# Altium project Practica RADAR.PrjPCB (part 2 of 3)

## Sheet USB PHY.SchDoc: USB PHY
size A4; Organization: GMR UPM; DocumentNumber: 4; Revision: A; SheetNumber: 4; SheetTotal: 8
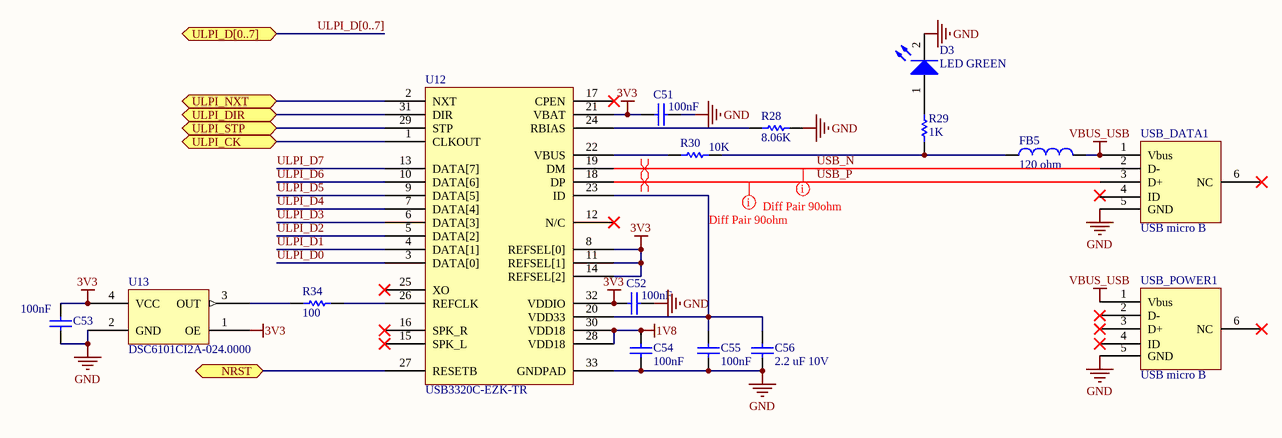
[diagram p3: USB PHY.SchDoc]

### Parts
C51  100nF  [0603 Cap]
C52  100nF  [0603 Cap]
C53  100nF  [0603 Cap]
C54  100nF  [0603 Cap]
C55  100nF  [0603 Cap]
C56  2.2 uF 10V  [0603 Cap]
D3  LED GREEN  [0603 LED]
FB5  120 ohm  [INDC1608X08L]
R28  8.06K  [0603 Res]
R29  1K  [0603 Res]
R30  10K  [0603 Res]
R34  100  [RESC1005X04L]
U12  USB3320C-EZK-TR  [QFN127P600-8N]
U13  DSC6101CI2A-024.0000  [DFN 3.2x2.5]
USB_DATA1  USB micro B  [USB-MicroB]
USB_POWER1  USB micro B  [USB-MicroB]

### Ports
NRST (bidir), ULPI_CK (bidir), ULPI_D[0..7] (bidir), ULPI_DIR (bidir), ULPI_NXT (bidir), ULPI_STP (bidir)

### Nets
1V8: C54.2 U12.28(VDD18) U12.30(VDD18)
3V3: C51.2 C52.2 C53.2 U12.8(REFSEL[0]) U12.11(REFSEL[1]) U12.14(REFSEL[2]) U12.21(VBAT) U12.32(VDDIO) U13.1(OE) U13.4(VCC)
GND: C51.1 C52.1 C53.1 C54.1 C55.1 C56.1 D3.2(C) R28.2 U12.33(GNDPAD) U13.2(GND) USB_DATA1.5(GND) USB_POWER1.5(GND)
VBUS_USB: FB5.2 USB_DATA1.1(Vbus) USB_POWER1.1(Vbus)
NRST: U12.27(RESETB) ; port NRST
ULPI_CK: U12.1(CLKOUT) ; port ULPI_CK
ULPI_D0: U12.3(DATA[0])
ULPI_D1: U12.4(DATA[1])
ULPI_D2: U12.5(DATA[2])
ULPI_D3: U12.6(DATA[3])
ULPI_D4: U12.7(DATA[4])
ULPI_D5: U12.9(DATA[5])
ULPI_D6: U12.10(DATA[6])
ULPI_D7: U12.13(DATA[7])
ULPI_DIR: U12.31(DIR) ; port ULPI_DIR
ULPI_NXT: U12.2(NXT) ; port ULPI_NXT
ULPI_STP: U12.29(STP) ; port ULPI_STP
USB_N: U12.19(DM) USB_DATA1.2(D-)
USB_P: U12.18(DP) USB_DATA1.3(D+)
NetC55_2: C55.2 C56.2 U12.20(VDD33) U12.23(ID)
NetD3_1: D3.1(A) R29.2
NetFB5_1: FB5.1 R29.1 R30.2
NetR28_1: R28.1 U12.24(RBIAS)
NetR30_1: R30.1 U12.22(VBUS)
NetR34_1: R34.1 U13.3(OUT)
NetR34_2: R34.2 U12.26(REFCLK)

Not connected (* = marked no-connect by the designer): U12 12(N/C)* 15(SPK_L)* 16(SPK_R)* 17(CPEN)* 25(XO)*; USB_DATA1 4(ID) 6(NC)*; USB_POWER1 2(D-)* 3(D+)* 4(ID)* 6(NC)*

### Buses and harness runs
bus ULPI_D[0..7] = port ULPI_D[0..7]

### Layout directives
differential pair: USB_N, USB_P
Diff Pair 90ohm: Undefined: USB_N, USB_P

### Notes on the sheet
- Title
- Size:
- A4
- Number:
- Revision:
- Date:
- Sheet
- of

### Library data of the parts
C51-C55 = C0603C104K4RACTU: CAP CER 0.1UF 16V X7R 0603; Manufacturer: KEMET; Capacitance: 0.1µF; Tolerance: ±10%; Supplier 1: Digi-Key; Manufacturer Part Number: C0603C104K4RACTU; RoHS: RoHS Compliant; Category: Capacitors; Stock 1: 4491346; Pricing 1: 1=0.09, 10=0.022, 25=0.016, 50=0.0122, 100=0.01, 250=0.00836, 500=0.0071, 1000=0.00559 (EUR); Packaging: Digi-Reel®; Part Status: Active; Voltage - Rated: 16V; Temperature Coefficient: X7R; Operating Temperature: -55°C ~ 125°C; Features: -; Ratings: -; Applications: General Purpose; Failure Rate: -; Mounting Type: Surface Mount, MLCC; Package / Case: 0603 (1608 Metric); Size / Dimension: 0.063" L x 0.031" W (1.60mm x 0.80mm); Height - Seated (Max): -; Thickness (Max): 0.034" (0.87mm); Lead Spacing: -; Lead Style: -; ComponentLink1URL: http://www.kemet.com/docfinder?Partnumber=C0603C104K4RACTU; ComponentLink1Description: http://www.kemet.com/docfinder?Partnumber=C0603C104K4RACTU; Supplier Part Number 1: 399-1096-6-ND
C56 = CL10B225KP8NNNC: CAP CER 2.2UF 10V X7R 0603; Manufacturer: Samsung Electro-Mechanics America, Inc.; Capacitance: 2.2µF; Tolerance: ±10%; Supplier 1: Digi-Key; Manufacturer Part Number: CL10B225KP8NNNC; RoHS: RoHS Compliant; Category: Capacitors; Stock 1: 226342; Pricing 1: 1=0.15, 10=0.105, 25=0.0764, 50=0.0592, 100=0.0491, 250=0.04068, 500=0.03444, 1000=0.02851 (EUR); Packaging: Digi-Reel®; Part Status: Active; Voltage - Rated: 10V; Temperature Coefficient: X7R; Operating Temperature: -55°C ~ 125°C; Features: -; Ratings: -; Applications: General Purpose; Mounting Type: Surface Mount, MLCC; Package / Case: 0603 (1608 Metric); Size / Dimension: 0.063" L x 0.031" W (1.60mm x 0.80mm); Height - Seated (Max): -; Thickness (Max): 0.035" (0.90mm); Lead Spacing: -; Lead Style: -; ComponentLink1URL: http://www.samsungsem.com/kr/support/product-search/mlcc/__icsFiles/afieldfile/2016/08/18/S_CL10B225KP8NNNC.pdf; ComponentLink1Description: http://www.samsungsem.com/kr/support/product-search/mlcc/__icsFiles/afieldfile/2016/08/18/S_CL10B225KP8NNNC.pdf; Supplier Part Number 1: 1276-1134-6-ND
D3 = LTST-C191KGKT: LED GREEN CLEAR 0603 SMD; Manufacturer: Lite-On Inc.; Lens Color: Colorless; Millicandela Rating: 35mcd; Lens Style/Size: Rectangle with Flat Top, 1.10mm x 0.80mm; Voltage - Forward (Vf) (Typ): 2V; Current - Test: 20mA; Viewing Angle: 130°; Wavelength - Dominant: 571nm; Wavelength - Peak: 574nm; Supplier 1: Digi-Key; Manufacturer Part Number: LTST-C191KGKT; RoHS: RoHS Compliant; Category: Optoelectronics; Stock 1: 1105619; Pricing 1: 1=0.27, 10=0.197, 25=0.1456, 100=0.1039, 250=0.07068, 500=0.06234, 1000=0.04884, 2500=0.0478 (EUR); Packaging: Digi-Reel®; Part Status: Active; Color: Green; Lens Transparency: Clear; Mounting Type: Surface Mount; Features: -; Package / Case: 0603 (1608 Metric); Size / Dimension: 1.60mm L x 0.80mm W; Height (Max): 0.55mm; ComponentLink1URL: http://optoelectronics.liteon.com/upload/download/DS22-2000-228/S_110_LTST-C191KGKT.pdf; ComponentLink1Description: http://optoelectronics.liteon.com/upload/download/DS22-2000-228/S_110_LTST-C191KGKT.pdf; Supplier Part Number 1: 160-1446-6-ND
FB5 = BLM18PG121SN1D: FERRITE BEAD 120 OHM 0603 1LN; Manufacturer: Murata Electronics North America; Filter Type: Power Line; Number of Lines: 1; Impedance @ Frequency: 120 Ohm @ 100MHz; Current Rating (Max): 2A; DC Resistance (DCR) (Max): 50 mOhm; Supplier 1: Digi-Key; Manufacturer Part Number: BLM18PG121SN1D; RoHS: RoHS Compliant; Category: Filters; Stock 1: 1305577; Pricing 1: 1=0.09, 10=0.067, 25=0.06, 50=0.0438, 100=0.038, 250=0.02996, 500=0.0253, 1000=0.02132 (EUR); Packaging: Cut Tape (CT); Part Status: Active; Ratings: -; Operating Temperature: -55°C ~ 125°C; Package / Case: 0603 (1608 Metric); Mounting Type: Surface Mount; Height (Max): 0.037" (0.95mm); Size / Dimension: 0.063" L x 0.031" W (1.60mm x 0.80mm); ComponentLink1URL: http://www.murata.com/en-us/products/productdata/8796738650142/ENFA0003.pdf; ComponentLink1Description: http://www.murata.com/en-us/products/productdata/8796738650142/ENFA0003.pdf; Supplier Part Number 1: 490-1037-1-ND
R28 = RC0603FR-078K06L: RES SMD 8.06K OHM 1% 1/10W 0603; Manufacturer: Yageo; Power (Watts): 0.1W, 1/10W; Temperature Coefficient: ±100ppm/°C; Supplier 1: Digi-Key; Manufacturer Part Number: RC0603FR-078K06L; RoHS: RoHS Compliant; Category: Resistors; Stock 1: 336883; Pricing 1: 1=0.09, 10=0.013, 100=0.0053, 1000=0.00235, 2500=0.00204 (EUR); Packaging: Cut Tape (CT); Part Status: Active; Tolerance: ±1%; Composition: Thick Film; Features: Moisture Resistant; Operating Temperature: -55°C ~ 155°C; Package / Case: 0603 (1608 Metric); Supplier Device Package: 0603; Size / Dimension: 0.063" L x 0.031" W (1.60mm x 0.80mm); Height - Seated (Max): 0.022" (0.55mm); Failure Rate: -; ComponentLink1URL: http://www.yageo.com/documents/recent/PYu-RC_Group_51_RoHS_L_7.pdf; ComponentLink1Description: http://www.yageo.com/documents/recent/PYu-RC_Group_51_RoHS_L_7.pdf; Supplier Part Number 1: 311-8.06KHRCT-ND
R29 = RC0603FR-071KL: RES SMD 1K OHM 1% 1/10W 0603; Manufacturer: Yageo; Power (Watts): 0.1W, 1/10W; Temperature Coefficient: ±100ppm/°C; Supplier 1: Digi-Key; Manufacturer Part Number: RC0603FR-071KL; RoHS: RoHS Compliant; Category: Resistors; Stock 1: 10099217; Pricing 1: 1=0.09, 10=0.012, 25=0.0088, 50=0.0066, 100=0.0049, 250=0.00372, 500=0.00296, 1000=0.00218 (EUR); Packaging: Digi-Reel®; Part Status: Active; Resistance (Ohms): 1k; Tolerance: ±1%; Composition: Thick Film; Features: Moisture Resistant; Operating Temperature: -55°C ~ 155°C; Package / Case: 0603 (1608 Metric); Supplier Device Package: 0603; Size / Dimension: 0.063" L x 0.031" W (1.60mm x 0.80mm); Height - Seated (Max): 0.022" (0.55mm); Failure Rate: -; ComponentLink1URL: http://www.yageo.com/documents/recent/PYu-RC_Group_51_RoHS_L_7.pdf; ComponentLink1Description: http://www.yageo.com/documents/recent/PYu-RC_Group_51_RoHS_L_7.pdf; Supplier Part Number 1: 311-1.00KHRDKR-ND
R30 = RC0603FR-0710KL: RES SMD 10K OHM 1% 1/10W 0603; Manufacturer: Yageo; Power (Watts): 0.1W, 1/10W; Temperature Coefficient: ±100ppm/°C; Supplier 1: Digi-Key; Manufacturer Part Number: RC0603FR-0710KL; RoHS: RoHS Compliant; Category: Resistors; Stock 1: 17023109; Pricing 1: 1=0.09, 10=0.012, 25=0.0088, 50=0.0066, 100=0.0049, 250=0.00372, 500=0.00296, 1000=0.00218 (EUR); Packaging: Cut Tape (CT); Part Status: Active; Resistance (Ohms): 10k; Tolerance: ±1%; Composition: Thick Film; Features: Moisture Resistant; Operating Temperature: -55°C ~ 155°C; Package / Case: 0603 (1608 Metric); Supplier Device Package: 0603; Size / Dimension: 0.063" L x 0.031" W (1.60mm x 0.80mm); Height - Seated (Max): 0.022" (0.55mm); Failure Rate: -; ComponentLink1URL: http://www.yageo.com/documents/recent/PYu-RC_Group_51_RoHS_L_7.pdf; ComponentLink1Description: http://www.yageo.com/documents/recent/PYu-RC_Group_51_RoHS_L_7.pdf; Supplier Part Number 1: 311-10.0KHRCT-ND
R34 = MCR01MRTF1000: RES 100 OHM 1/16W 1% 0402 SMD; Manufacturer: Rohm Semiconductor; Power (Watts): 0.063W, 1/16W; Temperature Coefficient: ±100ppm/°C; Supplier 1: Digi-Key; Supplier Part Number 1: RHM100CDCT-ND; Manufacturer Part Number: MCR01MRTF1000; RoHS: RoHS Compliant; Category: Resistors; Stock 1: 128227; Pricing 1: 1=0.09, 10=0.011, 25=0.008, 100=0.0046, 250=0.00348, 500=0.00278, 1000=0.00205, 5000=0.00147 (EUR); Packaging: Cut Tape (CT); Resistance (Ohms): 100; Tolerance: ±1%; Composition: Thick Film; Features: -; Operating Temperature: -55°C ~ 155°C; Package / Case: 0402 (1005 Metric); Supplier Device Package: 0402 (1005 Metric); Size / Dimension: 0.039" L x 0.020" W (1.00mm x 0.50mm); Height: 0.016" (0.40mm); Number of Terminations: 2; ComponentLink1URL: http://rohmfs.rohm.com/en/products/databook/datasheet/passive/resistor/chip_resistor/mcr_g.pdf; ComponentLink1Description: http://rohmfs.rohm.com/en/products/databook/datasheet/passive/resistor/chip_resistor/mcr_g.pdf
U12 = USB3320C-EZK-TR: IC TXRX USB 2.0 FLEXPWR 32QFN; Manufacturer: Microchip Technology; Protocol: USB 2.0; Number of Drivers/Receivers: 1/1; Duplex: Half; Voltage - Supply: 1.8 V ~ 3.3 V; Supplier 1: Digi-Key; Manufacturer Part Number: USB3320C-EZK-TR; RoHS: RoHS Compliant; Category: Integrated Circuits (ICs); Stock 1: 21726; Pricing 1: 1=1.4, 25=1.166, 100=1.0666 (EUR); Packaging: Cut Tape (CT); Part Status: Active; Type: Transceiver; Data Rate: -; Operating Temperature: -40°C ~ 85°C; Mounting Type: Surface Mount; Package / Case: 32-VFQFN Exposed Pad; Supplier Device Package: 32-QFN (5x5); ComponentLink1URL: http://www.microchip.com/mymicrochip/filehandler.aspx?ddocname=en562261; ComponentLink1Description: http://www.microchip.com/mymicrochip/filehandler.aspx?ddocname=en562261; Supplier Part Number 1: USB3320C-EZK-CT-ND
U13 = DSC6101CI2A-024.0000: ULTRA-LOW POWER,MEMS OSCILLATOR,; Manufacturer: Microchip Technology; Function: Enable/Disable; Output: CMOS; Voltage - Supply: 1.71 V ~ 3.63 V; Frequency Stability: ±25ppm; Current - Supply (Max): 3mA (Typ); Current - Supply (Disable) (Max): 10.5µA; Supplier 1: Digi-Key; Manufacturer Part Number: DSC6101CI2A-024.0000; RoHS: RoHS Compliant; Category: Crystals, Oscillators, Resonators; Stock 1: 812; Pricing 1: 1=0.77, 25=0.6448, 100=0.6205 (EUR); Packaging: Tube; Part Status: Active; Type: MEMS (Silicon); Operating Temperature: -40°C ~ 85°C; Ratings: AEC-Q100; Mounting Type: Surface Mount; Package / Case: 4-SMD, No Lead; Size / Dimension: 0.126" L x 0.098" W (3.20mm x 2.50mm); Height - Seated (Max): 0.035" (0.90mm); ComponentLink1URL: http://www.microchip.com/mymicrochip/filehandler.aspx?ddocname=en587492; ComponentLink1Description: http://www.microchip.com/mymicrochip/filehandler.aspx?ddocname=en587492; Supplier Part Number 1: DSC6101CI2A-024.0000-ND

## Sheet LowFreqSignal_V2.SchDoc: Low Freq Signal
size A4; Organization: GMR UPM; DocumentNumber: 5; Revision: A; SheetNumber: 5; SheetTotal: 8
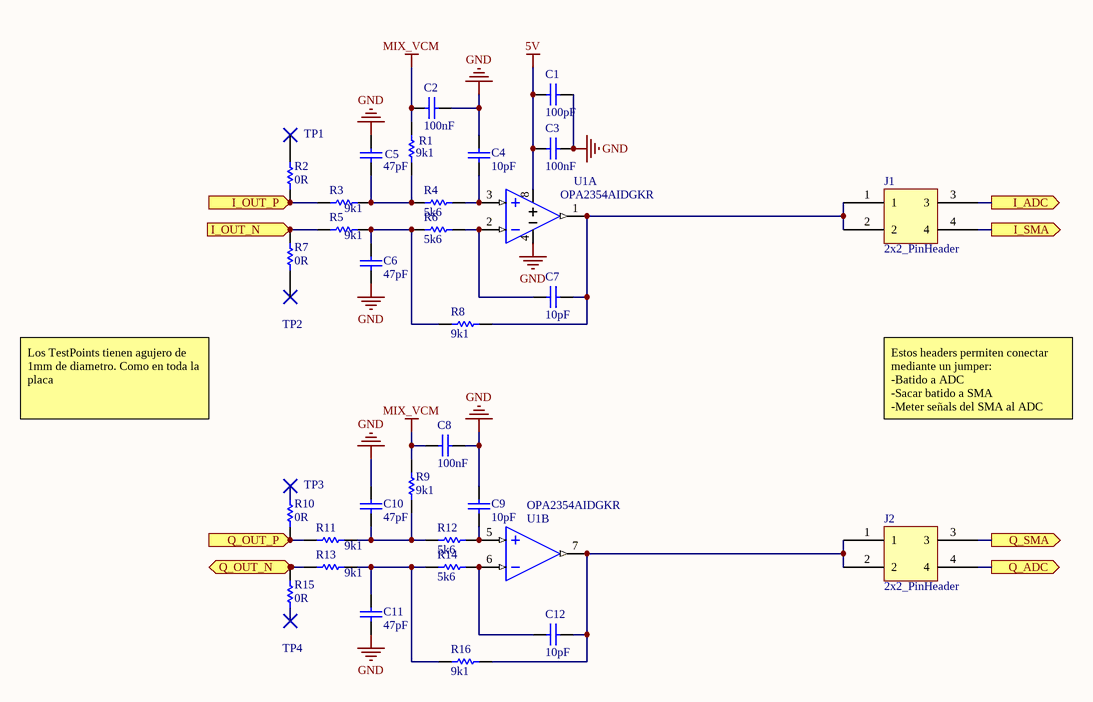
[diagram p4: LowFreqSignal_V2.SchDoc]

### Parts
C1  100pF  [0603 Cap]
C2  100nF  [0603 Cap]
C3  100nF  [0603 Cap]
C4  10pF  [0603 Cap]
C5  47pF  [0603 Cap]
C6  47pF  [0603 Cap]
C7  10pF  [0603 Cap]
C8  100nF  [0603 Cap]
C9  10pF  [0603 Cap]
C10  47pF  [0603 Cap]
C11  47pF  [0603 Cap]
C12  10pF  [0603 Cap]
J1  2x2_PinHeader  [2x2_PinHeader]
J2  2x2_PinHeader  [2x2_PinHeader]
R1  9k1  [0603 Res]
R2  0R  [0603 Res]
R3  9k1  [0603 Res]
R4  5k6  [0603 Res]
R5  9k1  [0603 Res]
R6  5k6  [0603 Res]
R7  0R  [0603 Res]
R8  9k1  [0603 Res]
R9  9k1  [0603 Res]
R10  0R  [0603 Res]
R11  9k1  [0603 Res]
R12  5k6  [0603 Res]
R13  9k1  [0603 Res]
R14  5k6  [0603 Res]
R15  0R  [0603 Res]
R16  9k1  [0603 Res]
TP1  TEST_POINT_PIN  [TESTPOINT]  (value not drawn)  (no BOM)
TP2  TEST_POINT_PIN  [TESTPOINT]  (value not drawn)  (no BOM)
TP3  TEST_POINT_PIN  [TESTPOINT]  (value not drawn)  (no BOM)
TP4  TEST_POINT_PIN  [TESTPOINT]  (value not drawn)  (no BOM)
U1  OPA2354AIDGKR  [MSOP-8]  (parts A,B of 2)

### Ports
I_ADC (out), I_OUT_N (in), I_OUT_P (in), I_SMA (out), Q_ADC (out), Q_OUT_N (in), Q_OUT_P (in), Q_SMA (out)

### Nets
5V: C1.1 C3.1 U1.8(V+)
GND: C1.2 C2.2 C3.2 C4.2 C5.2 C6.1 C8.2 C9.2 C10.2 C11.1 U1.4(V-)
MIX_VCM: C2.1 C8.1 R1.1 R9.1
I_OUT_N: R5.2 R7.2 ; port I_OUT_N
I_OUT_P: R2.2 R3.1 ; port I_OUT_P
I_SMA: J1.4 ; port I_SMA
PA1: J1.3 ; port I_ADC
PA2: J2.4 ; port Q_ADC
Q_OUT_N: R13.2 R15.2 ; port Q_OUT_N
Q_OUT_P: R10.2 R11.2 ; port Q_OUT_P
Q_SMA: J2.3 ; port Q_SMA
NetC4_1: C4.1 R4.1 U1.3(IN+A)
NetC5_1: C5.1 R1.2 R3.2 R4.2
NetC6_2: C6.2 R5.1 R6.2 R8.2
NetC7_1: C7.1 R6.1 U1.2(IN-A)
NetC7_2: C7.2 J1.1 J1.2 R8.1 U1.1(OUTA)
NetC9_1: C9.1 R12.1 U1.5(IN+B)
NetC10_1: C10.1 R9.2 R11.1 R12.2
NetC11_2: C11.2 R13.1 R14.2 R16.2
NetC12_1: C12.1 R14.1 U1.6(IN-B)
NetC12_2: C12.2 J2.1 J2.2 R16.1 U1.7(OUTB)
NetR2_1: R2.1 TP1.1
NetR7_1: R7.1 TP2.1
NetR10_1: R10.1 TP3.1
NetR15_1: R15.1 TP4.1

### Notes on the sheet
- Los TestPoints tienen agujero de 1mm de diametro. Como en toda la placa
- Estos headers permiten conectar mediante un jumper:
  -Batido a ADC
  -Sacar batido a SMA
  -Meter señals del SMA al ADC
- Title
- Size:
- A4
- Number:
- Revision:
- Date:
- Sheet
- of

### Library data of the parts
C1 = CL10B101KB8NNNC: CAP CER 100PF 50V X7R 0603; Manufacturer: Samsung Electro-Mechanics America, Inc.; Tolerance: ±10%; Supplier 1: Digi-Key; Manufacturer Part Number: CL10B101KB8NNNC; RoHS: RoHS Compliant; Category: Capacitors; Stock 1: 270807; Pricing 1: 1=0.08, 10=0.026, 100=0.0116, 500=0.00832, 1000=0.00653 (EUR); Packaging: Cut Tape (CT); Part Status: Active; Voltage - Rated: 50V; Temperature Coefficient: X7R; Operating Temperature: -55°C ~ 125°C; Features: -; Ratings: -; Applications: General Purpose; Mounting Type: Surface Mount, MLCC; Package / Case: 0603 (1608 Metric); Size / Dimension: 0.063" L x 0.032" W (1.60mm x 0.80mm); Height - Seated (Max): -; Thickness (Max): 0.035" (0.90mm); Lead Spacing: -; Lead Style: -; ComponentLink1URL: http://media.digikey.com/pdf/Data%20Sheets/Samsung%20PDFs/CL_Series_MLCC_ds.pdf; ComponentLink1Description: http://media.digikey.com/pdf/Data%20Sheets/Samsung%20PDFs/CL_Series_MLCC_ds.pdf; Supplier Part Number 1: 1276-1909-1-ND
C2 C3 C8 = C0603C104K4RACTU: as C51 on sheet USB PHY; Supplier 1: Digi-Key; Manufacturer Part Number: C0603C104K4RACTU; RoHS: RoHS Compliant; Category: Capacitors; Stock 1: 4491346; Pricing 1: 1=0.09, 10=0.022, 25=0.016, 50=0.0122, 100=0.01, 250=0.00836, 500=0.0071, 1000=0.00559 (EUR); Packaging: Digi-Reel®; Part Status: Active; Voltage - Rated: 16V; Temperature Coefficient: X7R; Operating Temperature: -55°C ~ 125°C; Features: -; Ratings: -; Applications: General Purpose; Failure Rate: -; Mounting Type: Surface Mount, MLCC; Package / Case: 0603 (1608 Metric); Size / Dimension: 0.063" L x 0.031" W (1.60mm x 0.80mm); Height - Seated (Max): -; Thickness (Max): 0.034" (0.87mm); Lead Spacing: -; Lead Style: -; ComponentLink1URL: http://www.kemet.com/docfinder?Partnumber=C0603C104K4RACTU; ComponentLink1Description: http://www.kemet.com/docfinder?Partnumber=C0603C104K4RACTU; Supplier Part Number 1: 399-1096-6-ND
C4-C7 C9-C12 = C_0603: CAP CER 16V X7R 0603; Tolerance: 10; Voltage Rating: 16; Material: Ceramic; Mount: Surface Mount; Case/Package: 0603; Case Code (Metric): 1608; Case Code (Imperial): 0603; Capacitance: *; Dielectric: X7R; Voltage Rating (DC): 16; Termination: SMD; Composition: Ceramic; Voltage: 16; Length: 1.6; Height: 0.8; Width: 0.8; Thickness: 0.035; Depth: 0.8
R1-R16 = R_0603: SMD Resistor, 1%, 0.1W, 0603; Tolerance: 1; Power Rating: 100; Mount: Surface Mount; Case/Package: 0603; Pins: 2; Case Code (Imperial): 0603; Case Code (Metric): 1608; Termination: SMD; Length: 1.6; Height: 0.45; Width: 0.8; Depth: 0.8
TP1-TP4 = TEST_POINT_PIN: Test point for single pin
U1 = OPA2354AIDGKR: IC OPAMP VFB 100MHZ RRO 8VSSOP; Manufacturer: Texas Instruments; Amplifier Type: Voltage Feedback; Output Type: Rail-to-Rail; Slew Rate: 150 V/µs; -3db Bandwidth: 250MHz; Current - Supply: 4.9mA; Voltage - Supply, Single/Dual (±): 2.5 V ~ 5.5 V, ±1.25 V ~ 2.75 V; Supplier 1: Digi-Key; Manufacturer Part Number: OPA2354AIDGKR; RoHS: RoHS Compliant; Category: Integrated Circuits (ICs); Stock 1: 5751; Pricing 1: 1=2.24, 10=2.013, 100=1.6494, 500=1.4041, 1000=1.18418 (EUR); Packaging: Cut Tape (CT); Part Status: Active; Operating Temperature: -40°C ~ 125°C; Mounting Type: Surface Mount; Package / Case: 8-TSSOP, 8-MSOP (0.118", 3.00mm Width); Supplier Device Package: 8-VSSOP; ComponentLink1URL: http://www.ti.com/lit/ds/symlink/opa354.pdf; ComponentLink1Description: http://www.ti.com/lit/ds/symlink/opa354.pdf; Supplier Part Number 1: 296-12642-1-ND

## Sheet Connectors.SchDoc: Connectors
size A4; Organization: GMR UPM; DocumentNumber: 6; Revision: A; SheetNumber: 6; SheetTotal: 8
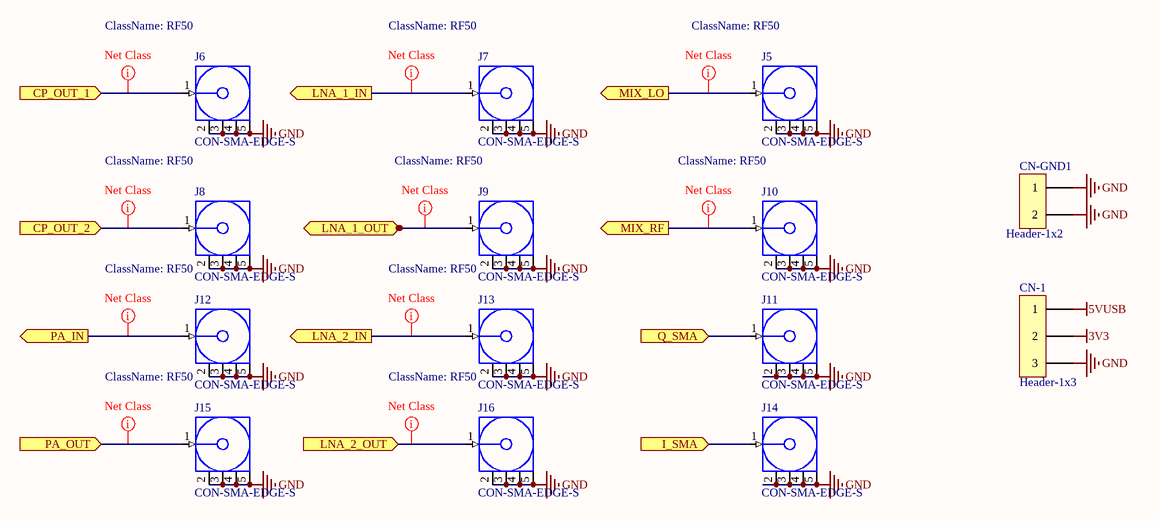
[diagram p5: Connectors.SchDoc]

### Parts
CN-1  Header-1x3  [Header-1x3-Jumper]
CN-GND1  Header-1x2  [HEADER-1x2-Jumper]
J5  CON-SMA-EDGE-S  [CON-SMA-EDGE-S]
J6  CON-SMA-EDGE-S  [CON-SMA-EDGE-S]
J7  CON-SMA-EDGE-S  [CON-SMA-EDGE-S]
J8  CON-SMA-EDGE-S  [CON-SMA-EDGE-S]
J9  CON-SMA-EDGE-S  [CON-SMA-EDGE-S]
J10  CON-SMA-EDGE-S  [CON-SMA-EDGE-S]
J11  CON-SMA-EDGE-S  [CON-SMA-EDGE-S]
J12  CON-SMA-EDGE-S  [CON-SMA-EDGE-S]
J13  CON-SMA-EDGE-S  [CON-SMA-EDGE-S]
J14  CON-SMA-EDGE-S  [CON-SMA-EDGE-S]
J15  CON-SMA-EDGE-S  [CON-SMA-EDGE-S]
J16  CON-SMA-EDGE-S  [CON-SMA-EDGE-S]

### Ports
CP_OUT_1 (in), CP_OUT_2 (in), I_SMA (in), LNA_1_IN (out), LNA_1_OUT (in), LNA_2_IN (out), LNA_2_OUT (in), MIX_LO (out), MIX_RF (out), PA_IN (out), PA_OUT (in), Q_SMA (in)

### Nets
3V3: CN-1.2
5VUSB: CN-1.1
GND: CN-1.3 CN-GND1.1 CN-GND1.2 J5.2(GND) J5.3(GND) J5.4(GND) J5.5(GND) J6.2(GND) J6.3(GND) J6.4(GND) J6.5(GND) J7.2(GND) J7.3(GND) J7.4(GND) J7.5(GND) J8.2(GND) J8.3(GND) J8.4(GND) J8.5(GND) J9.2(GND) J9.3(GND) J9.4(GND) J9.5(GND) J10.2(GND) J10.3(GND) J10.4(GND) J10.5(GND) J11.2(GND) J11.3(GND) J11.4(GND) J11.5(GND) J12.2(GND) J12.3(GND) J12.4(GND) J12.5(GND) J13.2(GND) J13.3(GND) J13.4(GND) J13.5(GND) J14.2(GND) J14.3(GND) J14.4(GND) J14.5(GND) J15.2(GND) J15.3(GND) J15.4(GND) J15.5(GND) J16.2(GND) J16.3(GND) J16.4(GND) J16.5(GND)
CP_OUT_1: J6.1(Signal) ; port CP_OUT_1
CP_OUT_2: J8.1(Signal) ; port CP_OUT_2
I_SMA: J14.1(Signal) ; port I_SMA
LNA_1_IN: J7.1(Signal) ; port LNA_1_IN
LNA_1_OUT: J9.1(Signal) ; port LNA_1_OUT
LNA_2_IN: J13.1(Signal) ; port LNA_2_IN
LNA_2_OUT: J16.1(Signal) ; port LNA_2_OUT
MIX_LO: J5.1(Signal) ; port MIX_LO
MIX_RF: J10.1(Signal) ; port MIX_RF
PA_IN: J12.1(Signal) ; port PA_IN
PA_OUT: J15.1(Signal) ; port PA_OUT
Q_SMA: J11.1(Signal) ; port Q_SMA

### Layout directives
net class RF50: CP_OUT_1, CP_OUT_2, LNA_1_IN, LNA_1_OUT, LNA_2_IN, LNA_2_OUT, MIX_LO, MIX_RF, PA_IN, PA_OUT

### Notes on the sheet
- Title
- Size:
- A4
- Number:
- Revision:
- Date:
- Sheet
- of

### Library data of the parts
J5-J16 = CON-SMA-EDGE-S: CONN SMA JACK STR EDGE MNT; Manufacturer: RF Solutions; Connector Type: Jack, Female Socket; Contact Termination: Solder; Supplier 1: Digi-Key; Manufacturer Part Number: CON-SMA-EDGE-S; RoHS: RoHS Compliant; Category: Connectors, Interconnects; Stock 1: 0; Pricing 1: 1=1.51 (EUR); Packaging: -; Part Status: Active; Connector Style: SMA; Shield Termination: Solder; Impedance: -; Mounting Type: Board Edge, End Launch; Mounting Feature: -; Cable Group: -; Fastening Type: Threaded; Features: -; Housing Color: -; Ingress Protection: -; Includes: -; Body Material: -; Body Finish: -; Center Contact Plating: -; Dielectric Material: -; Operating Temperature: -; Center Contact Material: -; Mating Cycles: -; Insertion Loss: -; ComponentLink1URL: https://media.digikey.com/pdf/Data%20Sheets/RF%20Solutions%20PDFs/CON-SMA-EDGE.pdf; ComponentLink1Description: https://media.digikey.com/pdf/Data%20Sheets/RF%20Solutions%20PDFs/CON-SMA-EDGE.pdf; Supplier Part Number 1: CON-SMA-EDGE-S-ND

## Sheet SPI and enables.SchDoc
size A4; DocumentNumber: 7; SheetNumber: 7; SheetTotal: 8
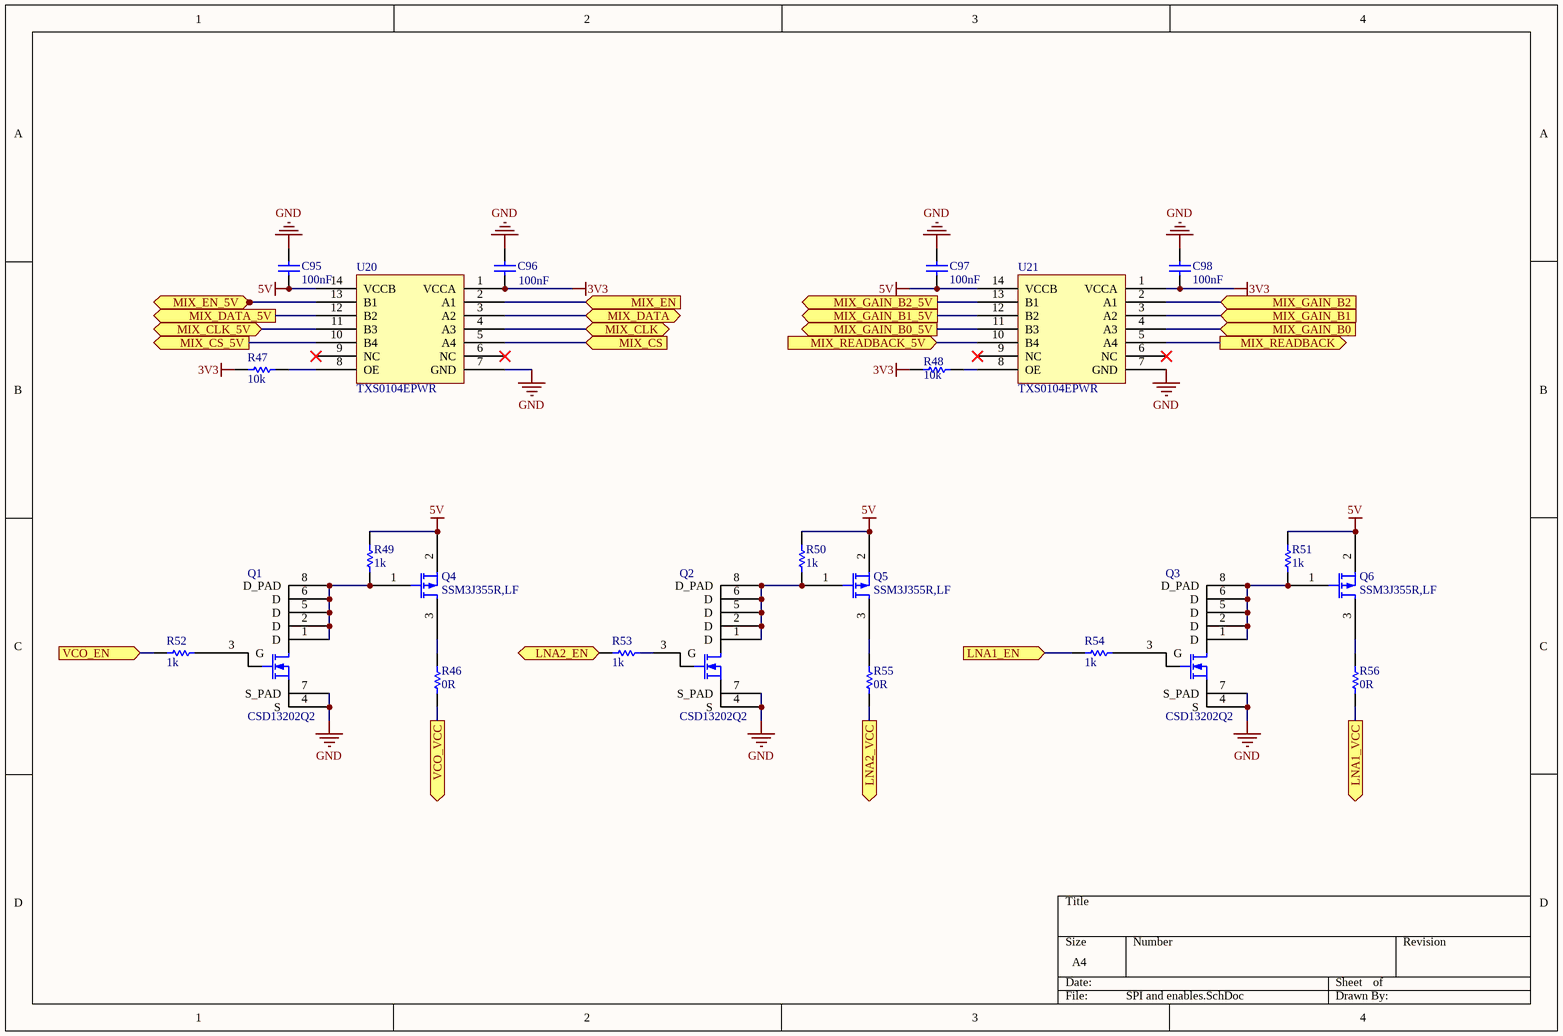
[diagram p6: SPI and enables.SchDoc]

### Parts
C95  100nF  [0603 Cap]
C96  100nF  [0603 Cap]
C97  100nF  [0603 Cap]
C98  100nF  [0603 Cap]
Q1  CSD13202Q2  [8-QFN]
Q2  CSD13202Q2  [8-QFN]
Q3  CSD13202Q2  [8-QFN]
Q4  SSM3J355R,LF  [SOT95P240X80-3M]
Q5  SSM3J355R,LF  [SOT95P240X80-3M]
Q6  SSM3J355R,LF  [SOT95P240X80-3M]
R46  0R  [0603 Res]
R47  10k  [0603 Res]
R48  10k  [0603 Res]
R49  1k  [0603 Res]
R50  1k  [0603 Res]
R51  1k  [0603 Res]
R52  1k  [0603 Res]
R53  1k  [0603 Res]
R54  1k  [0603 Res]
R55  0R  [0603 Res]
R56  0R  [0603 Res]
U20  TXS0104EPWR  [14-SOIC]
U21  TXS0104EPWR  [14-SOIC]

### Ports
LNA1_EN (in), LNA1_VCC (out), LNA2_EN (in), LNA2_VCC (out), MIX_CLK (bidir), MIX_CLK_5V (bidir), MIX_CS (in), MIX_CS_5V (out), MIX_DATA (bidir), MIX_DATA_5V (out), MIX_EN (in), MIX_EN_5V (out), MIX_GAIN_B0 (in), MIX_GAIN_B0_5V (out), MIX_GAIN_B1 (in), MIX_GAIN_B1_5V (out), MIX_GAIN_B2 (in), MIX_GAIN_B2_5V (out), MIX_READBACK (out), MIX_READBACK_5V (in), VCO_EN (in), VCO_VCC (out)

### Nets
3V3: C96.1 C98.1 R47.2 R48.2 U20.1(VCCA) U21.1(VCCA)
5V: C95.1 C97.1 Q4.2(S) Q5.2(S) Q6.2(S) R49.2 R50.2 R51.2 U20.14(VCCB) U21.14(VCCB)
GND: C95.2 C96.2 C97.2 C98.2 Q1.4(S) Q1.7(S_PAD) Q2.4(S) Q2.7(S_PAD) Q3.4(S) Q3.7(S_PAD) U20.7(GND) U21.7(GND)
LNA1_VCC: R56.1 ; port LNA1_VCC
LNA2_VCC: R55.1 ; port LNA2_VCC
MIX_CLK_5V: U20.11(B3) ; port MIX_CLK_5V
MIX_CS_5V: U20.10(B4) ; port MIX_CS_5V
MIX_DATA_5V: U20.12(B2) ; port MIX_DATA_5V
MIX_EN_5V: U20.13(B1) ; port MIX_EN_5V
MIX_GAIN_B0_5V: U21.11(B3) ; port MIX_GAIN_B0_5V
MIX_GAIN_B1_5V: U21.12(B2) ; port MIX_GAIN_B1_5V
MIX_GAIN_B2_5V: U21.13(B1) ; port MIX_GAIN_B2_5V
MIX_READBACK_5V: U21.10(B4) ; port MIX_READBACK_5V
PA15: U20.5(A4) ; port MIX_CS
PC10: U20.4(A3) ; port MIX_CLK
PC11: U21.5(A4) ; port MIX_READBACK
PC12: U20.3(A2) ; port MIX_DATA
PD0: U20.2(A1) ; port MIX_EN
PE2: U21.2(A1) ; port MIX_GAIN_B2
PE3: U21.3(A2) ; port MIX_GAIN_B1
PE4: U21.4(A3) ; port MIX_GAIN_B0
PE9: R54.2 ; port LNA1_EN
PE10: R53.2 ; port LNA2_EN
PE11: R52.2 ; port VCO_EN
VCO_VCC: R46.1 ; port VCO_VCC
NetQ1_1: Q1.1(D) Q1.2(D) Q1.5(D) Q1.6(D) Q1.8(D_PAD) Q4.1(G) R49.1
NetQ1_3: Q1.3(G) R52.1
NetQ2_1: Q2.1(D) Q2.2(D) Q2.5(D) Q2.6(D) Q2.8(D_PAD) Q5.1(G) R50.1
NetQ2_3: Q2.3(G) R53.1
NetQ3_1: Q3.1(D) Q3.2(D) Q3.5(D) Q3.6(D) Q3.8(D_PAD) Q6.1(G) R51.1
NetQ3_3: Q3.3(G) R54.1
NetQ4_3: Q4.3(D) R46.2
NetQ5_3: Q5.3(D) R55.2
NetQ6_3: Q6.3(D) R56.2
NetR47_1: R47.1 U20.8(OE)
NetR48_1: R48.1 U21.8(OE)

Not connected (* = marked no-connect by the designer): U20 6(NC)* 9(NC)*; U21 6(NC)* 9(NC)*

### Library data of the parts
C95-C98 = C_0603: as C4 on sheet LowFreqSignal_V2; Mount: Surface Mount; Case/Package: 0603; Case Code (Metric): 1608; Case Code (Imperial): 0603; Capacitance: *; Dielectric: X7R; Voltage Rating (DC): 16; Termination: SMD; Composition: Ceramic; Voltage: 16; Length: 1.6; Height: 0.8; Width: 0.8; Thickness: 0.035; Depth: 0.8
Q1-Q3 = CSD13202Q2: MOSFET N-CH 12V 76A 6SON; Manufacturer: Texas Instruments; FET Type: N-Channel; Current - Continuous Drain (Id) @ 25°C: 22A (Ta); Drive Voltage (Max Rds On,  Min Rds On): 2.5V, 4.5V; Rds On (Max) @ Id, Vgs: 9.3 mOhm @ 5A, 4.5V; Vgs(th) (Max) @ Id: 1.1V @ 250µA; Vgs (Max): ±8V; Power Dissipation (Max): 2.7W (Ta); Supplier 1: Digi-Key; Manufacturer Part Number: CSD13202Q2; RoHS: RoHS Compliant; Category: Discrete Semiconductor Products; Stock 1: 166239; Pricing 1: 1=0.58, 10=0.489, 100=0.3671, 500=0.26922, 1000=0.20803 (EUR); Packaging: Cut Tape (CT); Part Status: Active; Technology: MOSFET (Metal Oxide); FET Feature: -; Operating Temperature: -55°C ~ 150°C (TJ); Mounting Type: Surface Mount; Supplier Device Package: 6-WSON (2x2); Package / Case: 6-VDFN Exposed Pad; ComponentLink1URL: http://www.ti.com/lit/ds/symlink/csd13202q2.pdf; ComponentLink1Description: http://www.ti.com/lit/ds/symlink/csd13202q2.pdf; Supplier Part Number 1: 296-38911-1-ND
Q4-Q6 = SSM3J355R,LF: SMALL LOW ON RESISTANCE MOSFET; Manufacturer: Toshiba Semiconductor and Storage; FET Type: P-Channel; Current - Continuous Drain (Id) @ 25°C: 6A (Ta); Drive Voltage (Max Rds On,  Min Rds On): 1.8V, 4.5V; Rds On (Max) @ Id, Vgs: 30.1 mOhm @ 4A, 4.5V; Vgs(th) (Max) @ Id: 1V @ 1mA; Vgs (Max): ±10V; Power Dissipation (Max): 1W (Ta); Supplier 1: Digi-Key; Manufacturer Part Number: SSM3J355R,LF; RoHS: RoHS Compliant; Category: Discrete Semiconductor Products; Stock 1: 3232; Pricing 1: 1=0.43, 10=0.298, 100=0.1958, 500=0.11568, 1000=0.089 (EUR); Packaging: Cut Tape (CT); Part Status: Active; Technology: MOSFET (Metal Oxide); FET Feature: -; Operating Temperature: 150°C (TJ); Mounting Type: Surface Mount; Supplier Device Package: SOT-23F; Package / Case: SOT-23-3 Flat Leads; ComponentLink1URL: https://toshiba.semicon-storage.com/info/docget.jsp?did=55743&prodName=SSM3J355R; ComponentLink1Description: https://toshiba.semicon-storage.com/info/docget.jsp?did=55743&prodName=SSM3J355R; Supplier Part Number 1: SSM3J355RLFCT-ND
R46-R56 = R_0603: as R1 on sheet LowFreqSignal_V2; Mount: Surface Mount; Case/Package: 0603; Pins: 2; Case Code (Imperial): 0603; Case Code (Metric): 1608; Termination: SMD; Length: 1.6; Height: 0.45; Width: 0.8; Depth: 0.8
U20 U21 = TXS0104EPWR: IC TRNSLTR BIDIRECTIONAL 14TSSOP; Manufacturer: Texas Instruments; Translator Type: Voltage Level; Channels per Circuit: 4; Output Type: Open Drain, Push-Pull; Data Rate: 24Mbps; Supplier 1: Digi-Key; Manufacturer Part Number: TXS0104EPWR; RoHS: RoHS Compliant; Category: Integrated Circuits (ICs); Stock 1: 24531; Pricing 1: 1=1.15, 10=1.027, 100=0.8009, 500=0.66168, 1000=0.52237 (EUR); Packaging: Cut Tape (CT); Part Status: Active; Channel Type: Bidirectional; Input Signal: -; Output Signal: -; Operating Temperature: -40°C ~ 85°C (TA); Features: Auto-Direction Sensing; Mounting Type: Surface Mount; Package / Case: 14-TSSOP (0.173", 4.40mm Width); Supplier Device Package: 14-TSSOP; Base Part Number: TXS0104; ComponentLink1URL: http://www.ti.com/lit/ds/symlink/txs0104e.pdf; ComponentLink1Description: http://www.ti.com/lit/ds/symlink/txs0104e.pdf; Supplier Part Number 1: 296-20697-1-ND